# Altium schematic sheet Hydro-Node.SchDoc
size A; SheetNumber: 1; SheetTotal: 1
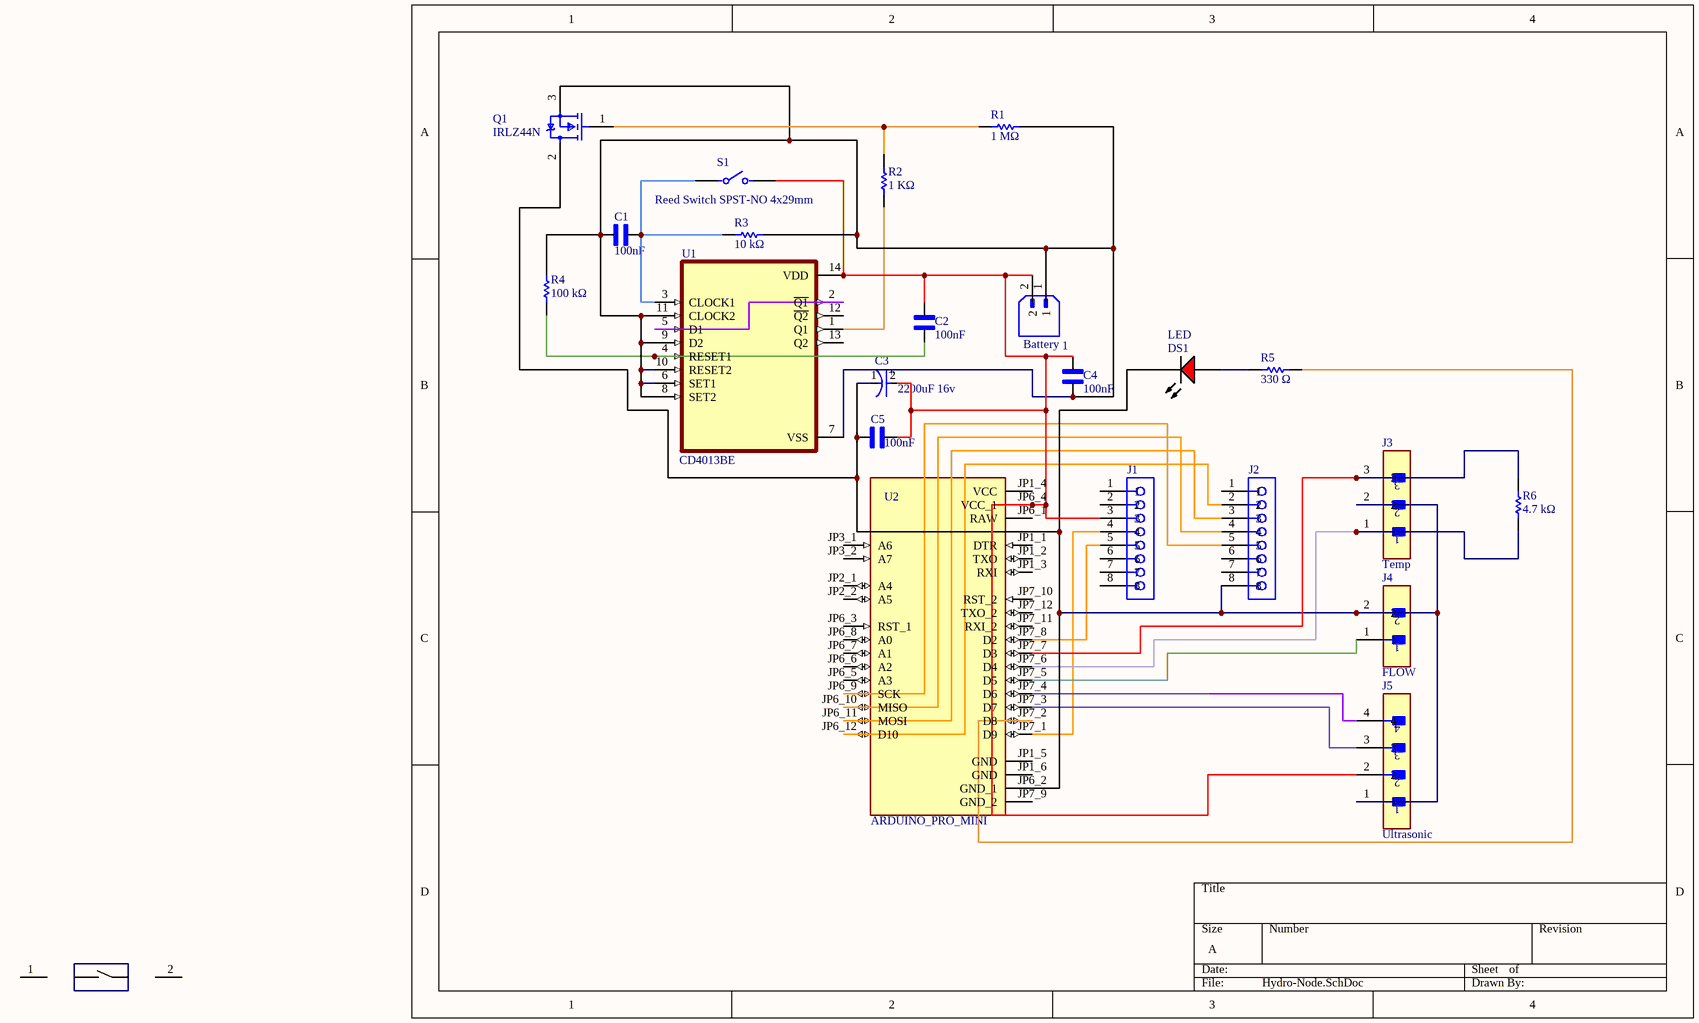
[diagram p0: Hydro-Node.SchDoc]

## Parts
1  Battery  [JST_B2B-XH-A_(LF)(SN)]
C1  100nF  [CAPRR508W50L508T317H508]
C2  100nF  [CAPRR508W50L508T317H508]
C3  2200uF 16v  [FP-RAD-TH-D_10_0_5-L_16_1-MFG]
C4  100nF  [CAPRR508W50L508T317H508]
C5  100nF  [CAPRR508W50L508T317H508]
DS1  LED  [INDPR60-254-520X380X650]
J1  61300811821  [61300811821]  (value not drawn)
J2  61300811821  [61300811821]  (value not drawn)
J3  Temp  [FP-B3B-XH-A_LF_SN-MFG]
J4  FLOW  [FP-B2B-XH-AM_LF_SN-MFG]
J5  Ultrasonic  [FP-B4B-XH-AM_LF_SN-MFG]
Q1  IRLZ44N  [FP-PG-TO220-3-MFG]
R1  1 MΩ  [RESA60-630X240]
R2  1 KΩ  [RESA60-630X240]
R3  10 kΩ  [RESA60-630X240]
R4  100 kΩ  [RESA60-630X240]
R5  330 Ω  [RESA60-630X240]
R6  4.7 kΩ  [RESA60-630X240]
S1  Reed Switch SPST-NO 4x29mm  [REEDSW-THT-D4L29-P35]
U1  CD4013BE  [DIP794W45P254L1969H508Q14]
U2  ARDUINO_PRO_MINI  [MODULE_ARDUINO_PRO_MINI]

## Nets
Net1_1: 1.1 C1.1 C4.2 Q1.3(S) R1.2 R3.2 R4.2 U1.6(SET1) U1.7(VSS) U1.8(SET2) U1.9(D2) U1.10(RESET2) U1.11(CLOCK2)
Net1_2: 1.2 C2.1 C3.2(A) C4.1 C5.2 J1.3 J5.2 S1.2 U1.14(VDD) U2.JP6_4(VCC_1)
NetC1_2: C1.2 R3.1 S1.1 U1.3(CLOCK1)
NetC2_2: C2.2 R4.1 U1.4(RESET1)
NetC3_1: C3.1(C) C5.1 DS1.2(K) J2.8 J3.2 J4.2 J5.1 Q1.2(D) U2.JP6_2(GND_1)
NetDS1_1: DS1.1(A) R5.1
NetJ1_4: J1.4 U2.JP7_1(D9)
NetJ1_5: J1.5 U2.JP7_8(D2)
NetJ2_2: J2.2 U2.JP6_12(D10)
NetJ2_3: J2.3 U2.JP6_11(MOSI)
NetJ2_4: J2.4 U2.JP6_10(MISO)
NetJ2_5: J2.5 U2.JP6_9(SCK)
NetJ3_1: J3.1 R6.1 U2.JP7_6(D4)
NetJ3_3: J3.3 R6.2 U2.JP7_7(D3)
NetJ4_1: J4.1 U2.JP7_5(D5)
NetJ5_3: J5.3 U2.JP7_3(D7)
NetJ5_4: J5.4 U2.JP7_4(D6)
NetQ1_1: Q1.1(G) R1.1 R2.2
NetR2_1: R2.1 U1.1(Q1)
NetR5_2: R5.2 U2.JP7_2(D8)
NetU1_2: U1.2(~{Q1}) U1.5(D1)

Not connected (* = marked no-connect by the designer): J1 1 2 6 7 8; J2 1 6 7; U1 12(~{Q2}) 13(Q2); U2 JP1_1(DTR) JP1_2(TXO) JP1_3(RXI) JP1_4(VCC) JP1_5(GND) JP1_6(GND) JP2_1(A4) JP2_2(A5) JP3_1(A6) JP3_2(A7) JP6_1(RAW) JP6_3(RST_1) JP6_5(A3) JP6_6(A2) JP6_7(A1) JP6_8(A0) JP7_9(GND_2) JP7_10(RST_2) JP7_11(RXI_2) JP7_12(TXO_2)

## Notes on the sheet
- (in symbol CMP-05427-001178-1) +

## Library data of the parts
1 = B2B-XH-A_(LF)(SN): Connector Header Through Hole 2 position 0.098 (2.50mm); MF: JST Sales; MP: B2B-XH-A (LF)(SN); SnapEDA_Link: https://www.snapeda.com/parts/B2B-XH-A%20(LF)(SN)/JST+Sales+America+Inc./view-part/?ref=snap; Package: None; Value: *; Check_prices: https://www.snapeda.com/parts/B2B-XH-A%20(LF)(SN)/JST+Sales+America+Inc./view-part/?ref=eda
C1 C2 C4 C5 = SR215E104MARTR1.: SR Series 5.08x5.08 mm 100 nF 50 V Â±20% Tol. Z5U Radial Lead/SkyCapÂ®; MF: AVX; SnapEDA_Link: https://www.snapeda.com/parts/SR215E104MARTR1/AVX/view-part/?ref=snap; Package: Radial AVX Interconnect / Elco; Capacitance: 100nF; MP: SR215E104MARTR1; Check_prices: https://www.snapeda.com/parts/SR215E104MARTR1/AVX/view-part/?ref=eda
C3 = CMP-05427-001178-1: Aluminum Electrolytic Capacitors (Radial Lead Type) 2200uF ±20% 6.3V
DS1 = CMP-1674-00005-1: Radial LED, 12.6 mcd, 20 mA, 2 V, -55 to 100 degC, 2-Pin THD, RoHS, Bulk; Shielding: Unshielded; Resistance: 0.045 Ohm; Current Rating: 3.6 A; Tolerance: 20%; PackageReference: LTL-1CHE; PackageDescription: 2-Pin Through Hole Device, Dia 3.8 mm, Pitch 2.54 mm; Case\Package: Radial; Length: 0.97 inch; Width: 0.62 inch; Height: 1.1 inch; Radiation Hardening: No; Lead Pitch: 11.44 mm; ComponentLink1URL: http://www.us.liteon.com/; ComponentLink1Description: Manufacturer URL; RoHSCompliant: true; Packaging: Tray; Mount: Through Hole; Min Operating Temperature: -40 degC; Max Operating Temperature: 130 degC; ComponentLink2URL: https://datasheet.ciiva.com/15117/getdatasheetpartid-187746-15117985.pdf; Package Quantity: 55; ComponentLink2Description: Datasheet; DatasheetVersion: Dec-03
J1 J2 = CMP-1502-01327-4: Btb Conn, Rcpt, 8Pos, 1Row, 2.54Mm Rohs Compliant: Yes; Contact Resistance: 20mΩ; Gender: Female; Current Rating: 3A; Operating Supply Voltage: 250V; Number of Pins: 8; Lead Pitch: 2.54mm; Orientation: Vertical; RoHS: Non-Compliant
J3 = CMP-17439-000014-3: CONN HEADER VERT 3POS 2.5MM; Max Voltage Rating (DC): 250V; Number of Positions: 3; Current Rating: 3A; Gender: Male; Wire/Cable Gauge: 22AWG; Contact Resistance: 20mR; Insulation Resistance: 1GR; Insulation Material: Nylon; Contact Plating: Tin; Depth: 5.75mm; Contact Type: Male Pin; Max Operating Temperature: 85°C; Insulation Color: Natural; Voltage Rating (AC): 250V; Color: Natural; Connector Type: Header; Orientation: Straight; Fastening Type: Detent; Housing Color: White; Min Operating Temperature: -25°C; Termination: Solder; Voltage Rating: 250V; Series: XH; Pitch: 2.5mm; Contact Shape: Square; Number of Rows: 1; Lead Free: Lead Free; Packaging: Bulk; Mount: Through Hole; Flammability Rating: UL94 V-0; Max Voltage Rating (AC): 250V; REACH SVHC: No SVHC; Housing Material: Polyamide; Contact Material: Brass; Lead Pitch: 2.5mm; Contact Finish - Mating: TIN; Length: 9.9mm; Max Current Rating: 3A; Number of Contacts: 3
J4 = CMP-17439-000037-1: CONN HEADER VERT 2POS 2.5MM; Max Voltage Rating (AC): 250V; Connector Type: Male Pin; Contact Resistance: 20mR; Max Current Rating: 3A; Number of Positions: 2; Series: XH; Contact Material: Brass; Mount: Through Hole; Housing Material: Polyamide; Contact Plating: Tin; Termination: Solder; Max Operating Temperature: 85°C; Depth: 5.75mm; Packaging: Bulk; Min Operating Temperature: -25°C; Contact Type: Male Pin; Color: Green; Pitch: 2.5mm; Length: 7.4mm; Lead Free: Lead Free; Number of Rows: 1; Fastening Type: Detent; Housing Color: White; Orientation: Straight
J5 = CMP-17439-000117-1: CONN HEADER VERT 4POS 2.5MM; Max Current Rating: 3A; Gender: Male; Contact Resistance: 20mR; Number of Positions: 4; Mated Stacking Heights: 9.8mm; Voltage Rating: 250V; Length: 12.4mm; Orientation: Straight; Pitch: 2.5mm; Housing Material: Polyamide; Max Operating Temperature: 85°C; Fastening Type: Detent; Housing Color: White; Series: XH; Packaging: Bulk; Number of Rows: 1; Insulation Material: Nylon; Contact Plating: Copper; Contact Type: Male Pin; Connector Type: Header; Color: Green; Insulation Color: Natural; Contact Finish - Mating: TIN; Lead Free: Lead Free; Termination: Solder; Depth: 5.75mm; Number of Pins: 4; Contact Material: Brass; Mount: Through Hole; Max Voltage Rating (AC): 250V; Flammability Rating: UL94 V-0; Min Operating Temperature: -25°C; Contact Shape: Square
Q1 = CMP-32901-000488-1: MOSFET N-CH 55V 47A TO220AB; Turn-On Delay Time: 11ns; Gate to Source Voltage (Vgs): 16V; Element Configuration: Single; Rds On Max: 22mR; Turn-Off Delay Time: 26ns; Max Power Dissipation: 110W; Threshold Voltage: 2V; Drain to Source Resistance: 35mR; Input Capacitance: 1.7nF; Continuous Drain Current (ID): 47A; Case/Package: TO-220; Lead Free: Lead Free; Halogen Free: Halogen Free; Packaging: Rail/Tube; Length: 0.414inch; Min Operating Temperature: -55°C; REACH SVHC: No SVHC; Number of Pins: 3; Width: 0.185inch; Drain to Source Voltage (Vdss): 55V; Power Dissipation: 110W; RoHS Compliant: Yes; Max Operating Temperature: 175°C; Height: 0.6inch; Max Dual Supply Voltage: 55V; Drain to Source Breakdown Voltage: 55V; Mount: Through Hole
R1 = CMP-1659-00070-1: Axial Resistor, 1 MOhm, +/- 1%, 250 mW, -55 to 155 degC, 2-Pin THD, RoHS, Bulk; Power Rating: 250 mW; Resistance: 1MΩ ohm; Voltage Rating: 250 V; ComponentLink1Description: Manufacturer URL; PackageReference: MFR-25; ComponentLink2Description: Datasheet; ComponentLink2URL: http://www.yageo.com/documents/recent/Yageo%20LR_MFR_2013.pdf; Tolerance: 1%; DatasheetVersion: Apr-13; Package Quantity: 200; Packaging: Bulk; Case\Package: Axial; RoHSCompliant: true; ComponentLink1URL: http://www.yageo.com/; Length: 0.248 inch; Min Operating Temperature: -55 degC; Mount: Through Hole; PackageDescription: 2-Pin Axial Lead, Dia 2.4 mm, Body Length 6.3 mm; Max Operating Temperature: 155 degC
R2 = CMP-1659-00075-1: Axial Resistor, 1 KOhm, +/- 1%, 250 mW, -55 to 155 degC, 2-Pin THD, RoHS, Bulk; Voltage Rating: 250 V; Resistance: 1kΩ ohm; Power Rating: 250 mW; ComponentLink2Description: Datasheet; RoHSCompliant: true; PackageReference: MFR-25; Case\Package: Axial; Max Operating Temperature: 155 degC; DatasheetVersion: Apr-13; Tolerance: 1%; ComponentLink1URL: http://www.yageo.com/; Length: 0.248 inch; ComponentLink2URL: http://www.yageo.com/documents/recent/Yageo%20LR_MFR_2013.pdf; Packaging: Bulk; Package Quantity: 200; PackageDescription: 2-Pin Axial Lead, Dia 2.4 mm, Body Length 6.3 mm; Min Operating Temperature: -55 degC; ComponentLink1Description: Manufacturer URL
R3 = CMP-1659-00074-2: Axial Resistor, 10 KOhm, +/- 1%, 0.25 W, -55 to 155 degC, 2-Pin THD, RoHS, Bulk; Manufacturer: Yageo; Temperature Coefficient: 100ppm\/degreesC; Voltage Rating: 250V; Voltage Rating (DC): 200V; Resistance: 10KΩ Ohm; Max Power Dissipation: 250mW; Datasheet URL: http://www.yageo.com/documents/recent/Yageo%20LR_MFR_2013.pdf; Packaging: Bulk; RoHSCompliant: True; Mount: ThroughHole; Package Reference: MFR-25; Termination: Axial; Composition: MetalFilm; Number of Terminations: 2; Package Quantity: 200; Mounting Technology: ThroughHole; Length: 0.248inch; Max Operating Temperature: 155degC; Min Operating Temperature: -55degC; Datasheet Version: 04/2013; Lead Free: LeadFree; Manufacturer URL: http://www.yageo.com/; Tolerance: 1%; Power Rating: 250mW; Package Description: 2-Pin Axial Lead, Dia 2.4 mm, Body Length 6.3 mm; Military Standard: Not; Case\/Package: Axial
R4 = CMP-1659-00073-1: Axial Resistor, 100 KOhm, +/- 1%, 0.25 W, -55 to 155 degC, 2-Pin THD, RoHS, Bulk; Voltage Rating: 250 V; Power Rating: 250 mW; Resistance: 100KΩ Ohm; PackageDescription: 2-Pin Axial Lead, Dia 2.4 mm, Body Length 6.3 mm; PackageReference: MFR-25; Length: 0.248 inch; ComponentLink2Description: Datasheet; Packaging: Bulk; DatasheetVersion: Apr-13; Package Quantity: 200; Min Operating Temperature: -55 degC; ComponentLink2URL: http://www.yageo.com/documents/recent/Yageo%20LR_MFR_2013.pdf; RoHSCompliant: true; ComponentLink1URL: http://www.yageo.com/; Tolerance: 1%; Case\Package: Axial; Mount: Through Hole; ComponentLink1Description: Manufacturer URL; Max Operating Temperature: 155 degC
R5 = CMP-1659-00070-1: Axial Resistor, 1 MOhm, +/- 1%, 250 mW, -55 to 155 degC, 2-Pin THD, RoHS, Bulk; Power Rating: 250 mW; Resistance: 330Ω ohm; Voltage Rating: 250 V; ComponentLink1Description: Manufacturer URL; PackageReference: MFR-25; ComponentLink2Description: Datasheet; ComponentLink2URL: http://www.yageo.com/documents/recent/Yageo%20LR_MFR_2013.pdf; Tolerance: 1%; DatasheetVersion: Apr-13; Package Quantity: 200; Packaging: Bulk; Case\Package: Axial; RoHSCompliant: true; ComponentLink1URL: http://www.yageo.com/; Length: 0.248 inch; Min Operating Temperature: -55 degC; Mount: Through Hole; PackageDescription: 2-Pin Axial Lead, Dia 2.4 mm, Body Length 6.3 mm; Max Operating Temperature: 155 degC
R6 = CMP-1659-00066-1: Axial Resistor, 4.75 KOhm, +/- 1%, 0.25 W, -55 to 155 degC, 2-Pin THD, RoHS, Bulk; Case\Package: 1210; Voltage Rating (DC): 25 V; Type (Capacitors): X7R; Resistance: 4.7KΩ Ohm; Tolerance: 10%; PackageReference: MFR-25; DatasheetVersion: Apr-13; PackageDescription: 2-Pin Axial Lead, Dia 2.4 mm, Body Length 6.3 mm; ComponentLink1URL: http://www.yageo.com/; Radiation Hardening: No; Mount: Surface Mount; Height: 2.5 mm; Pins: 2; Package Quantity: 1000; REACH SVHC: No SVHC; Case Code (Imperial): 1210; Packaging: Tape and Reel; Max Operating Temperature: 125 degC; Case Code (Metric): 3225; ComponentLink1Description: Manufacturer URL; Min Operating Temperature: -55 degC; ComponentLink2Description: Datasheet; Voltage Rating: 25 V; Length: 3.2 mm; ComponentLink2URL: http://www.yageo.com/documents/recent/Yageo%20LR_MFR_2013.pdf; RoHSCompliant: true; Width: 2.5 mm
S1 = REED-SWITCH-NO-D4L29: Magnetic reed switch, normally open, glass body 4.0 x 29.0 mm, axial leads bent for 35.0 mm through-hole pitch; pin to pad: 1>1)(2:2; Manufacturer Part Number: MDSM-4R-12-18; Manufacturer: Littelfuse; Standoff Height: 0mm; Value: SPST-NO Reed; Body Size: 4.0 x 29.0 mm glass; Contact Rating: TBD - see datasheet; Pull-In Sensitivity: TBD AT; Device Class L3: unset; Octopart: https://octopart.com/mdsm-4r-12-18-littelfuse-55632078; Device Class L1: Electromechanical; Mouser Description: Magnetic / Reed Switches MDSM-4R 5277 12-18; Category: Switch; ComponentLink2Description: Datasheet; RoHS: TRUE; Height: 2.84mm; Temperature: -40°C to +125°C; Lead Free: Yes; Package: MDSM-4; Temperature Range High: +125°C; Temperature Range Low: -40°C; Device Class L2: Switches; Automotive: No; Digikey Description: SWITCH REED SPST-NO 350MA 140V; ComponentLink2URL: https://www.littelfuse.com/~/media/electronics/datasheets/reed_switches/littelfuse_reed_switches_mdsm_4_datasheet.pdf.pdf; Lead Pitch: 35.0 mm
U1 = CD4013BE: CMOS Dual D-Type Flip Flop; MF: Texas Instruments; SnapEDA_Link: https://www.snapeda.com/parts/CD4013BE/Texas+Instruments/view-part/?ref=snap; Package: PDIP-14 Texas Instruments; Value: *; MP: CD4013BE; Check_prices: https://www.snapeda.com/parts/CD4013BE/Texas+Instruments/view-part/?ref=eda
U2 = ARDUINO_PRO_MINI: This board was developed for applications and installations where space is premium and projects are made as permanent set ups. Small, available in 3.3 V and 5 V versions, powered by ATmega328P.; MP: Arduino Pro Mini; SnapEDA_Link: https://www.snapeda.com/parts/Arduino%20Pro%20Mini/Arduino/view-part/?ref=snap; Package: None; Value: *; MF: Arduino; Check_prices: https://www.snapeda.com/parts/Arduino%20Pro%20Mini/Arduino/view-part/?ref=eda